# Altium schematic sheet Sheet3.SchDoc
size A2
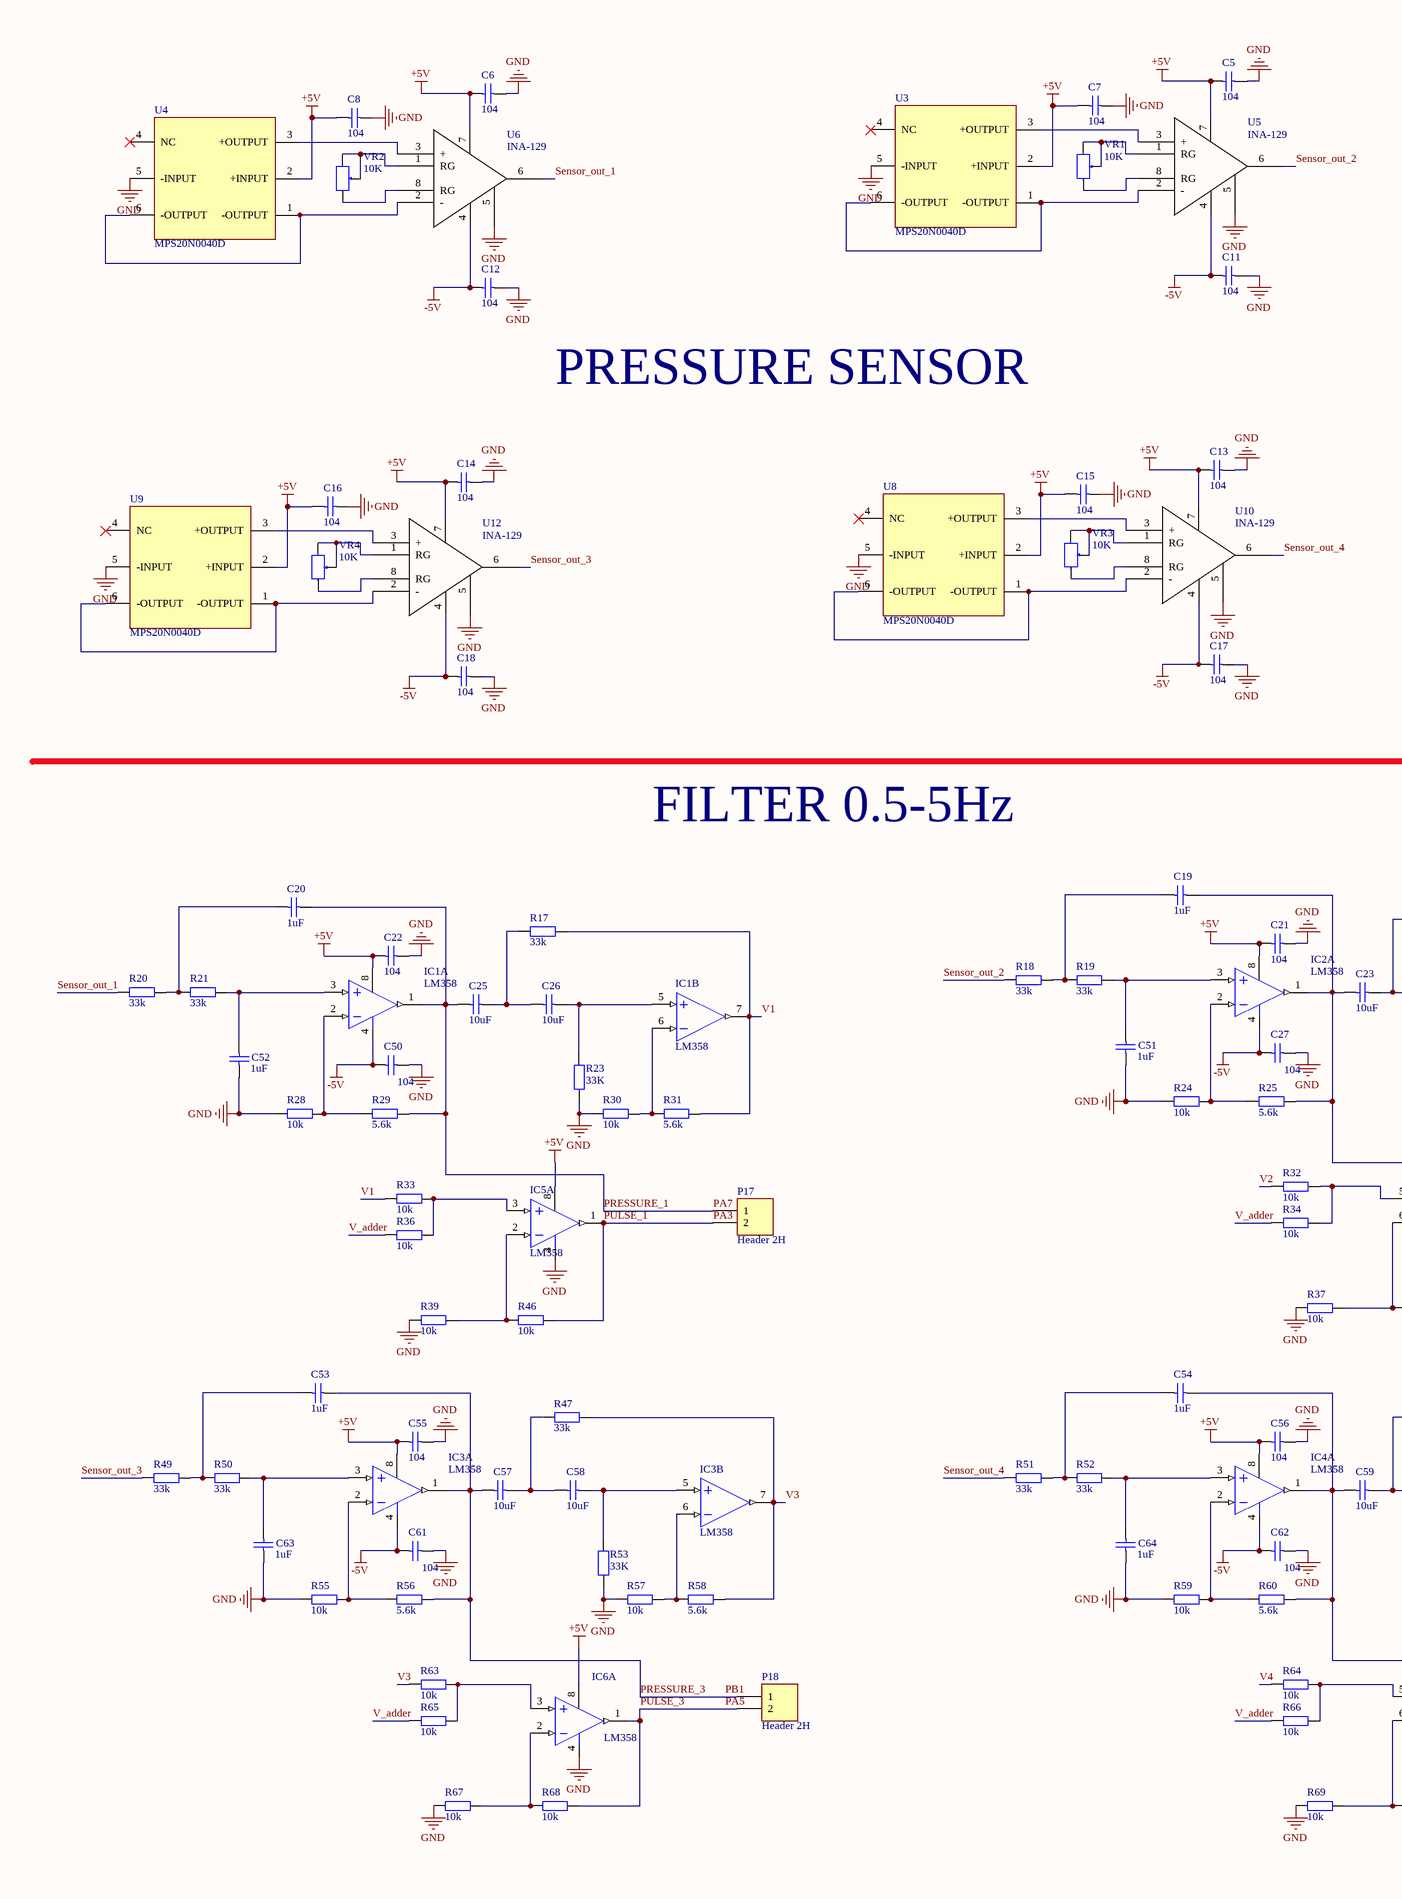
[diagram p0: Sheet3.SchDoc, left]
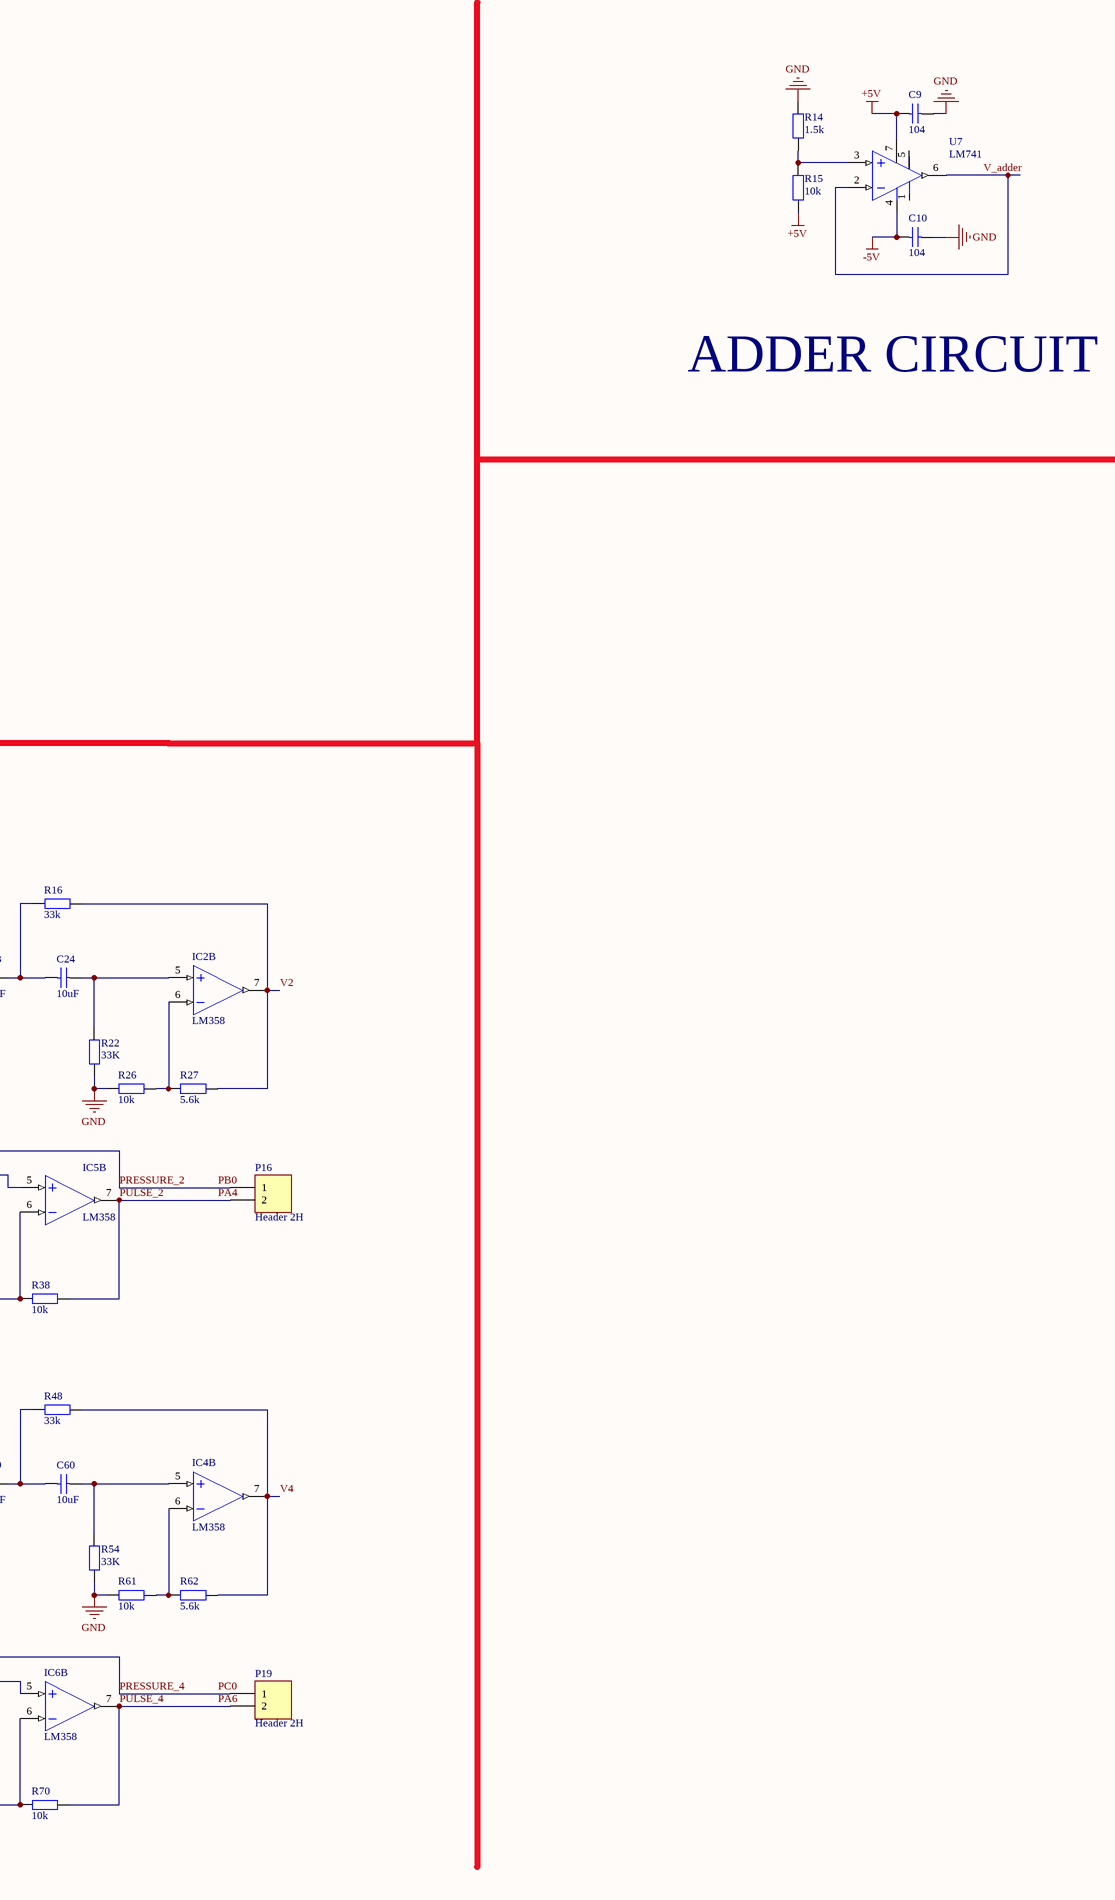
[diagram p1: Sheet3.SchDoc, right]

## Parts
C5  104  [0805 CAP]
C6  104  [0805 CAP]
C7  104  [0805 CAP]
C8  104  [0805 CAP]
C9  104  [0805 CAP]
C10  104  [0805 CAP]
C11  104  [0805 CAP]
C12  104  [0805 CAP]
C13  104  [0805 CAP]
C14  104  [0805 CAP]
C15  104  [0805 CAP]
C16  104  [0805 CAP]
C17  104  [0805 CAP]
C18  104  [0805 CAP]
C19  1uF  [0805 CAP]
C20  1uF  [0805 CAP]
C21  104  [0805 CAP]
C22  104  [0805 CAP]
C23  10uF  [0805 CAP]
C24  10uF  [0805 CAP]
C25  10uF  [0805 CAP]
C26  10uF  [0805 CAP]
C27  104  [0805 CAP]
C50  104  [0805 CAP]
C51  1uF  [0805 CAP]
C52  1uF  [0805 CAP]
C53  1uF  [0805 CAP]
C54  1uF  [0805 CAP]
C55  104  [0805 CAP]
C56  104  [0805 CAP]
C57  10uF  [0805 CAP]
C58  10uF  [0805 CAP]
C59  10uF  [0805 CAP]
C60  10uF  [0805 CAP]
C61  104  [0805 CAP]
C62  104  [0805 CAP]
C63  1uF  [0805 CAP]
C64  1uF  [0805 CAP]
IC1  LM358  [SOIC 8PIN]  (parts A,B of 2)
IC2  LM358  [SOIC 8PIN]  (parts A,B of 2)
IC3  LM358  [SOIC 8PIN]  (parts A,B of 2)
IC4  LM358  [SOIC 8PIN]  (parts A,B of 2)
IC5  LM358  [SOIC 8PIN]  (parts A,B of 2)
IC6  LM358  [SOIC 8PIN]  (parts A,B of 2)
P16  Header 2H  [HDR1X2]
P17  Header 2H  [HDR1X2]
P18  Header 2H  [HDR1X2]
P19  Header 2H  [HDR1X2]
R14  1.5k  [0805 RESISTOR]
R15  10k  [0805 RESISTOR]
R16  33k  [0805 RESISTOR]
R17  33k  [0805 RESISTOR]
R18  33k  [0805 RESISTOR]
R19  33k  [0805 RESISTOR]
R20  33k  [0805 RESISTOR]
R21  33k  [0805 RESISTOR]
R22  33K  [0805 RESISTOR]
R23  33K  [0805 RESISTOR]
R24  10k  [0805 RESISTOR]
R25  5.6k  [0805 RESISTOR]
R26  10k  [0805 RESISTOR]
R27  5.6k  [0805 RESISTOR]
R28  10k  [0805 RESISTOR]
R29  5.6k  [0805 RESISTOR]
R30  10k  [0805 RESISTOR]
R31  5.6k  [0805 RESISTOR]
R32  10k  [0805 RESISTOR]
R33  10k  [0805 RESISTOR]
R34  10k  [0805 RESISTOR]
R36  10k  [0805 RESISTOR]
R37  10k  [0805 RESISTOR]
R38  10k  [0805 RESISTOR]
R39  10k  [0805 RESISTOR]
R46  10k  [0805 RESISTOR]
R47  33k  [0805 RESISTOR]
R48  33k  [0805 RESISTOR]
R49  33k  [0805 RESISTOR]
R50  33k  [0805 RESISTOR]
R51  33k  [0805 RESISTOR]
R52  33k  [0805 RESISTOR]
R53  33K  [0805 RESISTOR]
R54  33K  [0805 RESISTOR]
R55  10k  [0805 RESISTOR]
R56  5.6k  [0805 RESISTOR]
R57  10k  [0805 RESISTOR]
R58  5.6k  [0805 RESISTOR]
R59  10k  [0805 RESISTOR]
R60  5.6k  [0805 RESISTOR]
R61  10k  [0805 RESISTOR]
R62  5.6k  [0805 RESISTOR]
R63  10k  [0805 RESISTOR]
R64  10k  [0805 RESISTOR]
R65  10k  [0805 RESISTOR]
R66  10k  [0805 RESISTOR]
R67  10k  [0805 RESISTOR]
R68  10k  [0805 RESISTOR]
R69  10k  [0805 RESISTOR]
R70  10k  [0805 RESISTOR]
U3  MPS20N0040D  [MPS20N0040D-S]
U4  MPS20N0040D  [MPS20N0040D-S]
U5  INA-129  [DIP 8]
U6  INA-129  [DIP 8]
U7  LM741  [SOIC 8PIN]
U8  MPS20N0040D  [MPS20N0040D-S]
U9  MPS20N0040D  [MPS20N0040D-S]
U10  INA-129  [DIP 8]
U12  INA-129  [DIP 8]
VR1  10K  [RVAR]
VR2  10K  [RVAR]
VR3  10K  [RVAR]
VR4  10K  [RVAR]

## Nets
+5V: C5.1 C6.1 C7.2 C8.2 C9.1 C13.1 C14.1 C15.2 C16.2 C21.1 C22.1 C55.1 C56.1 IC1.8(+V) IC2.8(+V) IC3.8(+V) IC4.8(+V) IC5.8(+V) IC6.8(+V) R15.2 U3.2(+INPUT) U4.2(+INPUT) U5.7 U6.7 U7.7(+V) U8.2(+INPUT) U9.2(+INPUT) U10.7 U12.7
-5V: C10.1 C11.2 C12.2 C17.2 C18.2 C27.1 C50.1 C61.1 C62.1 IC1.4(-V) IC2.4(-V) IC3.4(-V) IC4.4(-V) U5.4 U6.4 U7.4(-V) U10.4 U12.4
GND: C5.2 C6.2 C7.1 C8.1 C9.2 C10.2 C11.1 C12.1 C13.2 C14.2 C15.1 C16.1 C17.1 C18.1 C21.2 C22.2 C27.2 C50.2 C51.2 C52.2 C55.2 C56.2 C61.2 C62.2 C63.2 C64.2 IC5.4(-V) IC6.4(-V) R14.1 R22.1 R23.1 R24.1 R26.1 R28.1 R30.1 R37.1 R39.1 R53.1 R54.1 R55.1 R57.1 R59.1 R61.1 R67.1 R69.1 U3.5(-INPUT) U4.5(-INPUT) U5.5 U6.5 U8.5(-INPUT) U9.5(-INPUT) U10.5 U12.5
PA3: IC5.1(OUT) P17.2 R46.2  [also labelled PULSE_1]
PA4: IC5.7(OUT) P16.2 R38.2  [also labelled PULSE_2]
PA5: IC6.1(OUT) P18.2 R68.2  [also labelled PULSE_3]
PA6: IC6.7(OUT) P19.2 R70.2  [also labelled PULSE_4]
PA7: C20.2 C25.1 IC1.1(OUT) P17.1 R29.2  [also labelled PRESSURE_1]
PB0: C19.2 C23.1 IC2.1(OUT) P16.1 R25.2  [also labelled PRESSURE_2]
PB1: C53.2 C57.1 IC3.1(OUT) P18.1 R56.2  [also labelled PRESSURE_3]
PC0: C54.2 C59.1 IC4.1(OUT) P19.1 R60.2  [also labelled PRESSURE_4]
Sensor_out_1: R20.1 U6.6
Sensor_out_2: R18.1 U5.6
Sensor_out_3: R49.1 U12.6
Sensor_out_4: R51.1 U10.6
V1: IC1.7(OUT) R17.2 R31.2 R33.1
V2: IC2.7(OUT) R16.2 R27.2 R32.1
V3: IC3.7(OUT) R47.2 R58.2 R63.1
V4: IC4.7(OUT) R48.2 R62.2 R64.1
V_adder: R34.1 R36.1 R65.1 R66.1 U7.2(IN-) U7.6(OUT)
NetC19_1: C19.1 R18.2 R19.1
NetC20_1: C20.1 R20.2 R21.1
NetC23_2: C23.2 C24.1 R16.1
NetC24_2: C24.2 IC2.5(IN+) R22.2
NetC25_2: C25.2 C26.1 R17.1
NetC26_2: C26.2 IC1.5(IN+) R23.2
NetC51_1: C51.1 IC2.3(IN+) R19.2
NetC52_1: C52.1 IC1.3(IN+) R21.2
NetC53_1: C53.1 R49.2 R50.1
NetC54_1: C54.1 R51.2 R52.1
NetC57_2: C57.2 C58.1 R47.1
NetC58_2: C58.2 IC3.5(IN+) R53.2
NetC59_2: C59.2 C60.1 R48.1
NetC60_2: C60.2 IC4.5(IN+) R54.2
NetC63_1: C63.1 IC3.3(IN+) R50.2
NetC64_1: C64.1 IC4.3(IN+) R52.2
NetIC1_2: IC1.2(IN-) R28.2 R29.1
NetIC1_6: IC1.6(IN-) R30.2 R31.1
NetIC2_2: IC2.2(IN-) R24.2 R25.1
NetIC2_6: IC2.6(IN-) R26.2 R27.1
NetIC3_2: IC3.2(IN-) R55.2 R56.1
NetIC3_6: IC3.6(IN-) R57.2 R58.1
NetIC4_2: IC4.2(IN-) R59.2 R60.1
NetIC4_6: IC4.6(IN-) R61.2 R62.1
NetIC5_2: IC5.2(IN-) R39.2 R46.1
NetIC5_3: IC5.3(IN+) R33.2 R36.2
NetIC5_5: IC5.5(IN+) R32.2 R34.2
NetIC5_6: IC5.6(IN-) R37.2 R38.1
NetIC6_2: IC6.2(IN-) R67.2 R68.1
NetIC6_3: IC6.3(IN+) R63.2 R65.2
NetIC6_5: IC6.5(IN+) R64.2 R66.2
NetIC6_6: IC6.6(IN-) R69.2 R70.1
NetR14_2: R14.2 R15.1 U7.3(IN+)
NetU3_1: U3.1(-OUTPUT) U3.6(-OUTPUT) U5.2(-)
NetU3_3: U3.3(+OUTPUT) U5.3(+)
NetU4_1: U4.1(-OUTPUT) U4.6(-OUTPUT) U6.2(-)
NetU4_3: U4.3(+OUTPUT) U6.3(+)
NetU5_1: U5.1(RG) VR1.1 VR1.2
NetU5_8: U5.8(RG) VR1.3
NetU6_1: U6.1(RG) VR2.1 VR2.2
NetU6_8: U6.8(RG) VR2.3
NetU8_1: U8.1(-OUTPUT) U8.6(-OUTPUT) U10.2(-)
NetU8_3: U8.3(+OUTPUT) U10.3(+)
NetU9_1: U9.1(-OUTPUT) U9.6(-OUTPUT) U12.2(-)
NetU9_3: U9.3(+OUTPUT) U12.3(+)
NetU10_1: U10.1(RG) VR3.1 VR3.2
NetU10_8: U10.8(RG) VR3.3
NetU12_1: U12.1(RG) VR4.1 VR4.2
NetU12_8: U12.8(RG) VR4.3

Not connected (* = marked no-connect by the designer): U3 4(NC)*; U4 4(NC)*; U7 1(Vos) 5(Vos); U8 4(NC)*; U9 4(NC)*

## Notes on the sheet
- PRESSURE SENSOR
- ADDER CIRCUIT
- FILTER 0.5-5Hz

## Library data of the parts
C5-C27 C50-C64 = CAP CERAMIC: Published: 8-Jun-2000; LatestRevisionDate: 17-Jul-2002; LatestRevisionNote: Re-released for DXP Platform.; PackageReference: RAD-0.3; Publisher: Altium Limited
IC1-IC6 = LM358: Low-Power Dual Operational Amplifier; Value: LM358
R14-R34 R36-R39 R46-R70 = RESISTOR: Value: R1/4W - 1K
VR1-VR4 = VAR RES: Value: VR 10K
P16-P19 = Header 2H: LatestRevisionDate: 17-Jul-2002; LatestRevisionNote: Re-released for DXP Platform.; Publisher: Altium Limited